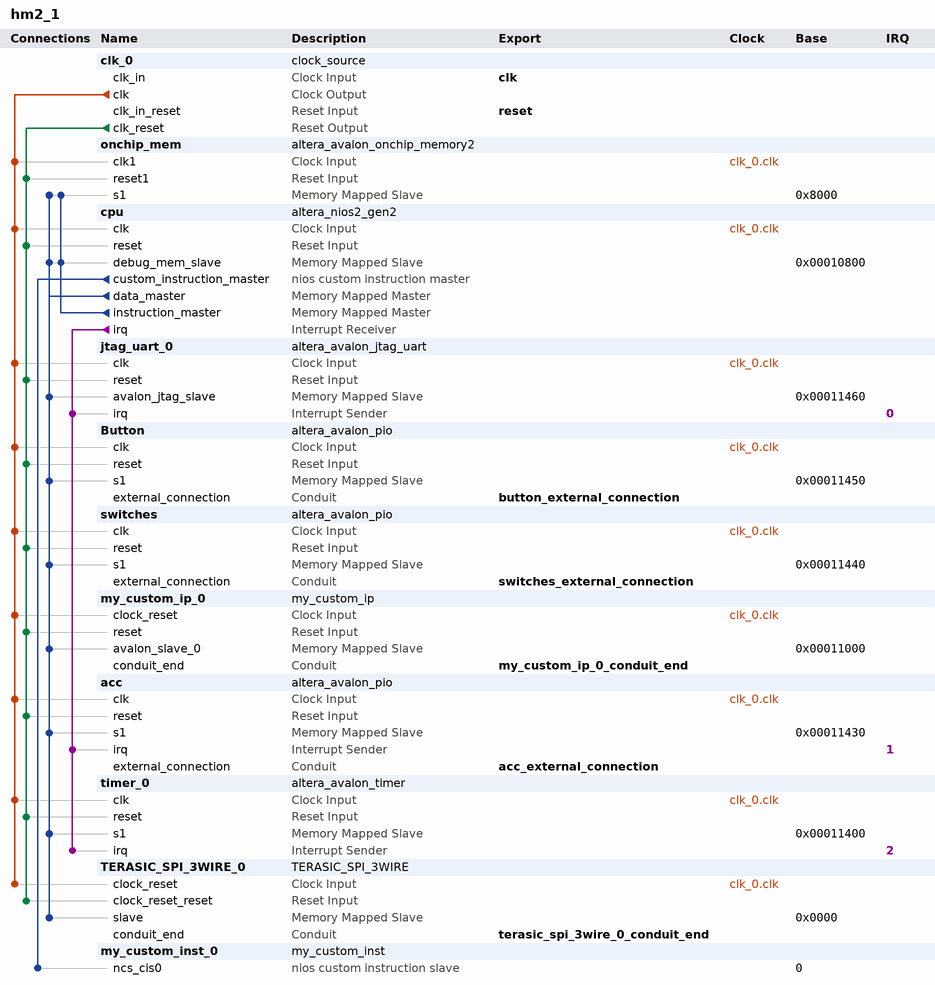
[diagram p0: system contents]
# Platform Designer (Qsys) system hm2_1, Cyclone IV E EP4CE22F17C6
# Parameters at their usual value, and those the tool derives, are not listed.
package require -exact qsys 15.0
create_system hm2_1
set_project_property DEVICE_FAMILY {Cyclone IV E}
set_project_property DEVICE EP4CE22F17C6

add_instance clk_0 clock_source 15.0
set_instance_parameter_value clk_0 clockFrequency 50000000

add_instance onchip_mem altera_avalon_onchip_memory2 15.0
set_instance_parameter_value onchip_mem dataWidth 32
set_instance_parameter_value onchip_mem dualPort false
set_instance_parameter_value onchip_mem initMemContent true
set_instance_parameter_value onchip_mem initializationFileName onchip_mem.hex
set_instance_parameter_value onchip_mem memorySize 20000

add_instance cpu altera_nios2_gen2 15.0
set_instance_parameter_value cpu dcache_size 2048
set_instance_parameter_value cpu exceptionSlave onchip_mem.s1
set_instance_parameter_value cpu icache_size 4096
set_instance_parameter_value cpu impl Tiny
set_instance_parameter_value cpu resetSlave onchip_mem.s1

add_instance jtag_uart_0 altera_avalon_jtag_uart 15.0
set_instance_parameter_value jtag_uart_0 simInteractiveOptions NO_INTERACTIVE_WINDOWS

add_instance Button altera_avalon_pio 15.0
set_instance_parameter_value Button direction Input
set_instance_parameter_value Button width 1

add_instance switches altera_avalon_pio 15.0
set_instance_parameter_value switches direction Input
set_instance_parameter_value switches width 4

add_instance my_custom_ip_0 my_custom_ip 1.0

add_instance acc altera_avalon_pio 15.0
set_instance_parameter_value acc captureEdge true
set_instance_parameter_value acc direction Input
set_instance_parameter_value acc generateIRQ true
set_instance_parameter_value acc width 1

add_instance timer_0 altera_avalon_timer 15.0
set_instance_parameter_value timer_0 period 1
set_instance_parameter_value timer_0 periodUnits MSEC

add_instance TERASIC_SPI_3WIRE_0 TERASIC_SPI_3WIRE 1.0

add_instance my_custom_inst_0 my_custom_inst 1.0

# connections
add_connection clk_0.clk acc.clk clock
add_connection clk_0.clk Button.clk clock
add_connection clk_0.clk cpu.clk clock
add_connection clk_0.clk jtag_uart_0.clk clock
add_connection clk_0.clk my_custom_ip_0.clock_reset clock
add_connection clk_0.clk onchip_mem.clk1 clock
add_connection clk_0.clk switches.clk clock
add_connection clk_0.clk TERASIC_SPI_3WIRE_0.clock_reset clock
add_connection clk_0.clk timer_0.clk clock
add_connection clk_0.clk_reset acc.reset reset
add_connection clk_0.clk_reset Button.reset reset
add_connection clk_0.clk_reset cpu.reset reset
add_connection clk_0.clk_reset jtag_uart_0.reset reset
add_connection clk_0.clk_reset my_custom_ip_0.reset reset
add_connection clk_0.clk_reset onchip_mem.reset1 reset
add_connection clk_0.clk_reset switches.reset reset
add_connection clk_0.clk_reset TERASIC_SPI_3WIRE_0.clock_reset_reset reset
add_connection clk_0.clk_reset timer_0.reset reset
add_connection cpu.data_master acc.s1 avalon
set_connection_parameter_value cpu.data_master/acc.s1 baseAddress 0x00011430
add_connection cpu.data_master Button.s1 avalon
set_connection_parameter_value cpu.data_master/Button.s1 baseAddress 0x00011450
add_connection cpu.data_master cpu.debug_mem_slave avalon
set_connection_parameter_value cpu.data_master/cpu.debug_mem_slave baseAddress 0x00010800
add_connection cpu.data_master jtag_uart_0.avalon_jtag_slave avalon
set_connection_parameter_value cpu.data_master/jtag_uart_0.avalon_jtag_slave baseAddress 0x00011460
add_connection cpu.data_master my_custom_ip_0.avalon_slave_0 avalon
set_connection_parameter_value cpu.data_master/my_custom_ip_0.avalon_slave_0 baseAddress 0x00011000
add_connection cpu.data_master onchip_mem.s1 avalon
set_connection_parameter_value cpu.data_master/onchip_mem.s1 baseAddress 0x8000
add_connection cpu.data_master switches.s1 avalon
set_connection_parameter_value cpu.data_master/switches.s1 baseAddress 0x00011440
add_connection cpu.data_master TERASIC_SPI_3WIRE_0.slave avalon
set_connection_parameter_value cpu.data_master/TERASIC_SPI_3WIRE_0.slave baseAddress 0x0000
add_connection cpu.data_master timer_0.s1 avalon
set_connection_parameter_value cpu.data_master/timer_0.s1 baseAddress 0x00011400
add_connection cpu.instruction_master cpu.debug_mem_slave avalon
set_connection_parameter_value cpu.instruction_master/cpu.debug_mem_slave baseAddress 0x00010800
add_connection cpu.instruction_master onchip_mem.s1 avalon
set_connection_parameter_value cpu.instruction_master/onchip_mem.s1 baseAddress 0x8000
add_connection cpu.irq acc.irq interrupt
set_connection_parameter_value cpu.irq/acc.irq irqNumber 1
add_connection cpu.irq jtag_uart_0.irq interrupt
set_connection_parameter_value cpu.irq/jtag_uart_0.irq irqNumber 0
add_connection cpu.irq timer_0.irq interrupt
set_connection_parameter_value cpu.irq/timer_0.irq irqNumber 2
add_connection cpu.custom_instruction_master my_custom_inst_0.ncs_cis0 nios_custom_instruction
set_connection_parameter_value cpu.custom_instruction_master/my_custom_inst_0.ncs_cis0 CIName my_custom_inst_0
set_connection_parameter_value cpu.custom_instruction_master/my_custom_inst_0.ncs_cis0 baseAddress 0

# exported interfaces
add_interface acc_external_connection conduit end
set_interface_property acc_external_connection EXPORT_OF acc.external_connection
add_interface button_external_connection conduit end
set_interface_property button_external_connection EXPORT_OF Button.external_connection
add_interface clk clock sink
set_interface_property clk EXPORT_OF clk_0.clk_in
add_interface my_custom_ip_0_conduit_end conduit end
set_interface_property my_custom_ip_0_conduit_end EXPORT_OF my_custom_ip_0.conduit_end
add_interface reset reset sink
set_interface_property reset EXPORT_OF clk_0.clk_in_reset
add_interface switches_external_connection conduit end
set_interface_property switches_external_connection EXPORT_OF switches.external_connection
add_interface terasic_spi_3wire_0_conduit_end conduit end
set_interface_property terasic_spi_3wire_0_conduit_end EXPORT_OF TERASIC_SPI_3WIRE_0.conduit_end

set_interconnect_requirement {$system} qsys_mm.clockCrossingAdapter HANDSHAKE
set_interconnect_requirement {$system} qsys_mm.enableEccProtection FALSE
set_interconnect_requirement {$system} qsys_mm.insertDefaultSlave FALSE
set_interconnect_requirement {$system} qsys_mm.maxAdditionalLatency 1

save_system hm2_1.qsys
